# EAGLE schematic FootPrint (EAGLE 7.6.0)
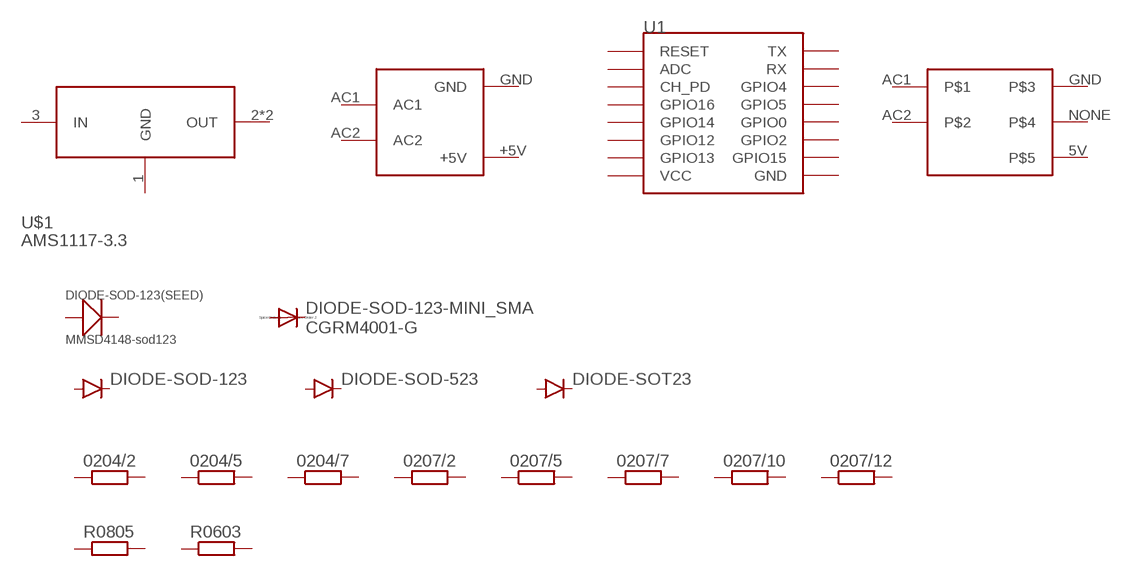
[diagram p0: schematic, sheet 1]

## Parts
0204/2  R-EU_0204/2V  [0204V]
0204/5  R-EU_0204/5  [0204/5]
0204/7  R-EU_0204/7  [0204/7]
0207/2  R-EU_0207/2V  [0207/2V]
0207/5  R-EU_0207/5V  [0207/5V]
0207/7  R-EU_0207/7  [0207/7]
0207/10  R-EU_0207/10  [0207/10]
0207/12  R-EU_0207/12  [0207/12]
DIODE-SOD-123  DIODESOD123  [SOD-123]
DIODE-SOD-123(SEED)  MMSD4148-sod123  SMD-DIODE-100V-200MA(SOD-123)  [SOD-123]
DIODE-SOD-123-MINI_SMA  CGRM4001-G  [SOD-123_MINI-SMA]
DIODE-SOD-523  DIODESOD523  [SOD523]
DIODE-SOT23  DIODESOT23  [SOT23-3]
R0603  R-EU_R0603  [R0603]
R0805  R-EU_R0805  [R0805]
U1  ESP12SMD  [ESP12-SMD]
U$1  AMS1117-3.3  [SOT-223]
U$2  HLK-PM01  [HLK-PM01]
U$3  POWERSUPPLY-5V-700MA  [POWERSUPPLY-5V-700MA]
Unconnected: 0204/2.1 0204/2.2 0204/5.1 0204/5.2 0204/7.1 0204/7.2 0207/2.1 0207/2.2 0207/5.1 0207/5.2 0207/7.1 0207/7.2 0207/10.1 0207/10.2 0207/12.1 0207/12.2 DIODE-SOD-123(SEED).+ DIODE-SOD-123(SEED).- DIODE-SOD-123-MINI_SMA.A DIODE-SOD-123-MINI_SMA.C DIODE-SOD-123.A DIODE-SOD-123.C DIODE-SOD-523.A DIODE-SOD-523.C DIODE-SOT23.1(A) DIODE-SOT23.3(C) R0603.1 R0603.2 R0805.1 R0805.2 U1.ADC U1.CH_PD U1.GND U1.GPIO0 U1.GPIO2 U1.GPIO4 U1.GPIO5 U1.GPIO12 U1.GPIO13 U1.GPIO14 U1.GPIO15 U1.GPIO16 U1.RESET U1.RXD0(RX) U1.TXD0(TX) U1.VCC U$1.1(GND) U$1.2(OUT) U$1.3(IN) U$1.4(OUT) U$2.+5V U$2.AC1 U$2.AC2 U$2.GND U$3.5V U$3.AC1 U$3.AC2 U$3.GND U$3.NONE

## Library data of the parts
0204/2 0204/5 0204/7 0207/2 0207/5 0207/7 0207/10 0207/12 R0603 R0805 = rcl:R-EU_: RESISTOR, European symbol
DIODE-SOD-123 DIODE-SOD-523 DIODE-SOT23 = SparkFun-DiscreteSemi:DIODE: Diode These are standard reverse protection diodes and small signal diodes. SMA package can handle up to about 1A. SOD-323 can handle about 200mA. What the SOD-323 package when ordering, there are some mfgs out there that are 5-pin packages.
DIODE-SOD-123(SEED) = Seeed-OPL-Diode:SMD-DIODE-100V-200MA(SOD-123): 304010007; MPN: MMSD4148
DIODE-SOD-123-MINI_SMA = diode:CGRM400*-G: Molded plasitc,JEDEC SOD-123/Mini SMA Source: Comchip CGRM4001-G.pdf
U1 = esp8266modules:ESP12: ESP8266 Wifi module 12
U$1 = AMS1117-3.3:AMS1117-3.3: 1A LOW DROPOUT VOLTAGE REGULATOR
U$2 = HLK-PM01:HLK-PM01
U$3 = PowerSupply-5V-700mA:POWERSUPPLY-5V-700MA